# Altium schematic sheet MCUs.SchDoc
size B; SheetNumber: 5; SheetTotal: 7
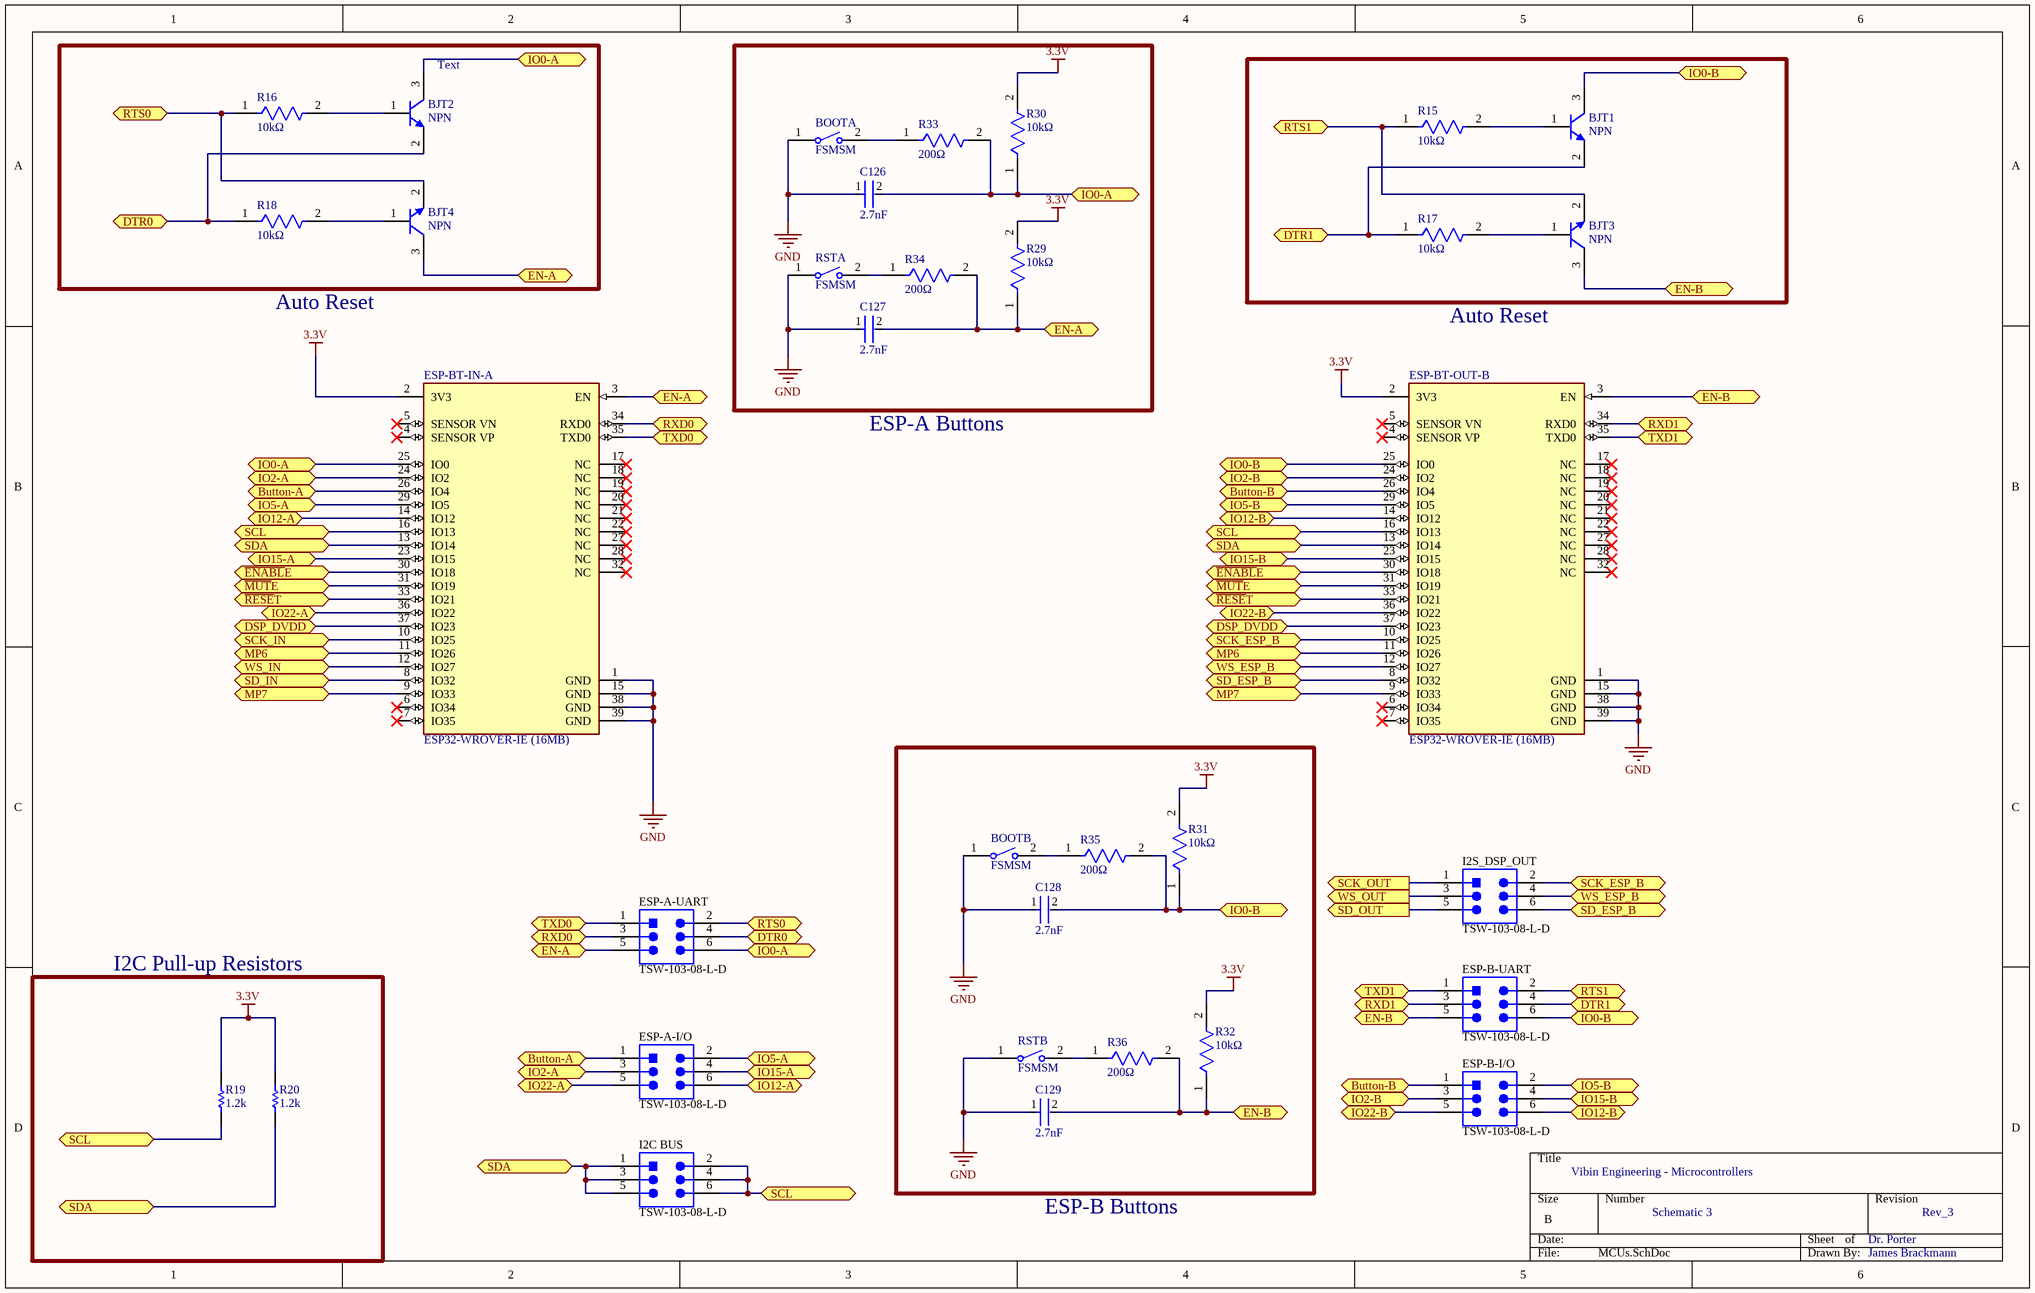
[diagram p0: MCUs.SchDoc]

## Parts
BJT1  NPN  [ONSC-SOT-23-3-318-08_V]
BJT2  NPN  [ONSC-SOT-23-3-318-08_V]
BJT3  NPN  [ONSC-SOT-23-3-318-08_V]
BJT4  NPN  [ONSC-SOT-23-3-318-08_V]
BOOTA  FSMSM  [TECO-FSMSM-2_V]
BOOTB  FSMSM  [TECO-FSMSM-2_V]
C126  2.7nF  [FP-C0402-BB-MFG]
C127  2.7nF  [FP-C0402-BB-MFG]
C128  2.7nF  [FP-C0402-BB-MFG]
C129  2.7nF  [FP-C0402-BB-MFG]
ESP-A-I/O  TSW-103-08-L-D  [SMTC-TSW-103-08-L-D_V]
ESP-A-UART  TSW-103-08-L-D  [SMTC-TSW-103-08-L-D_V]
ESP-B-I/O  TSW-103-08-L-D  [SMTC-TSW-103-08-L-D_V]
ESP-B-UART  TSW-103-08-L-D  [SMTC-TSW-103-08-L-D_V]
ESP-BT-IN-A  ESP32-WROVER-IE (16MB)  [FP-ESP32-WROVER-IE_16MB-MFG]
ESP-BT-OUT-B  ESP32-WROVER-IE (16MB)  [FP-ESP32-WROVER-IE_16MB-MFG]
I2C_BUS  TSW-103-08-L-D  [SMTC-TSW-103-08-L-D_V]
I2S_DSP_OUT  TSW-103-08-L-D  [SMTC-TSW-103-08-L-D_V]
R15  10kΩ  [FP-RC0603-0_55-IPC_C]
R16  10kΩ  [FP-RC0603-0_55-IPC_C]
R17  10kΩ  [FP-RC0603-0_55-IPC_C]
R18  10kΩ  [FP-RC0603-0_55-IPC_C]
R19  1.2k  [RESC1608X55X25LL10T15]
R20  1.2k  [RESC1608X55X25LL10T15]
R29  10kΩ  [FP-RC0603-0_55-IPC_C]
R30  10kΩ  [FP-RC0603-0_55-IPC_C]
R31  10kΩ  [FP-RC0603-0_55-IPC_C]
R32  10kΩ  [FP-RC0603-0_55-IPC_C]
R33  200Ω  [FP-ERJ2RK-IPC_A]
R34  200Ω  [FP-ERJ2RK-IPC_A]
R35  200Ω  [FP-ERJ2RK-IPC_A]
R36  200Ω  [FP-ERJ2RK-IPC_A]
RSTA  FSMSM  [TECO-FSMSM-2_V]
RSTB  FSMSM  [TECO-FSMSM-2_V]

## Blocks framed on the sheet
Text: BJT2 BJT4 R16 R18
I2C Pull-up Resistors: R19 R20

## Ports
Button-A (bidir), Button-B (bidir), DSP_DVDD (bidir), DTR0 (bidir), DTR1 (bidir), EN-A (bidir), EN-B (bidir), IO0-A (bidir), IO0-B (bidir), IO2-A (bidir), IO2-B (bidir), IO5-A (bidir), IO5-B (bidir), IO12-A (bidir), IO12-B (bidir), IO15-A (bidir), IO15-B (bidir), IO22-A (bidir), IO22-B (bidir), MP6 (bidir), MP7 (bidir), RTS0 (bidir), RTS1 (bidir), RXD0 (bidir), RXD1 (bidir), SCK_ESP_B (bidir), SCK_IN (bidir), SCK_OUT (out), SCL (bidir), SD_ESP_B (bidir), SD_IN (bidir), SD_OUT (out), SDA (bidir), TXD0 (bidir), TXD1 (bidir), WS_ESP_B (bidir), WS_IN (bidir), WS_OUT (out), ~{ENABL}E (bidir), ~{MUT}E (bidir), ~{RESE}T (bidir)

## Nets
3.3V: ESP-BT-IN-A.2(3V3) ESP-BT-OUT-B.2(3V3) R19.2 R20.2 R29.2 R30.2 R31.2 R32.2
GND: BOOTA.1 BOOTB.1 C126.1 C127.1 C128.1 C129.1 ESP-BT-IN-A.1(GND) ESP-BT-IN-A.15(GND) ESP-BT-IN-A.38(GND) ESP-BT-IN-A.39(GND) ESP-BT-OUT-B.1(GND) ESP-BT-OUT-B.15(GND) ESP-BT-OUT-B.38(GND) ESP-BT-OUT-B.39(GND) RSTA.1 RSTB.1
~{ENABL}E: ESP-BT-IN-A.30(IO18) ESP-BT-OUT-B.30(IO18) ; port ~{ENABL}E
~{MUT}E: ESP-BT-IN-A.31(IO19) ESP-BT-OUT-B.31(IO19) ; port ~{MUT}E
~{RESE}T: ESP-BT-IN-A.33(IO21) ESP-BT-OUT-B.33(IO21) ; port ~{RESE}T
Button-A: ESP-A-I/O.1 ESP-BT-IN-A.26(IO4) ; port Button-A
Button-B: ESP-B-I/O.1 ESP-BT-OUT-B.26(IO4) ; port Button-B
DSP_DVDD: ESP-BT-IN-A.37(IO23) ESP-BT-OUT-B.37(IO23) ; port DSP_DVDD
DTR0: BJT2.2(E) ESP-A-UART.4 R18.1 ; port DTR0
DTR1: BJT1.2(E) ESP-B-UART.4 R17.1 ; port DTR1
EN-A: BJT4.3(C) C127.2 ESP-A-UART.5 ESP-BT-IN-A.3(EN) R29.1 R34.2 ; port EN-A
EN-B: BJT3.3(C) C129.2 ESP-B-UART.5 ESP-BT-OUT-B.3(EN) R32.1 R36.2 ; port EN-B
IO0-A: BJT2.3(C) C126.2 ESP-A-UART.6 ESP-BT-IN-A.25(IO0) R30.1 R33.2 ; port IO0-A
IO0-B: BJT1.3(C) C128.2 ESP-B-UART.6 ESP-BT-OUT-B.25(IO0) R31.1 R35.2 ; port IO0-B
IO2-A: ESP-A-I/O.3 ESP-BT-IN-A.24(IO2) ; port IO2-A
IO2-B: ESP-B-I/O.3 ESP-BT-OUT-B.24(IO2) ; port IO2-B
IO5-A: ESP-A-I/O.2 ESP-BT-IN-A.29(IO5) ; port IO5-A
IO5-B: ESP-B-I/O.2 ESP-BT-OUT-B.29(IO5) ; port IO5-B
IO12-A: ESP-A-I/O.6 ESP-BT-IN-A.14(IO12) ; port IO12-A
IO12-B: ESP-B-I/O.6 ESP-BT-OUT-B.14(IO12) ; port IO12-B
IO15-A: ESP-A-I/O.4 ESP-BT-IN-A.23(IO15) ; port IO15-A
IO15-B: ESP-B-I/O.4 ESP-BT-OUT-B.23(IO15) ; port IO15-B
IO22-A: ESP-A-I/O.5 ESP-BT-IN-A.36(IO22) ; port IO22-A
IO22-B: ESP-B-I/O.5 ESP-BT-OUT-B.36(IO22) ; port IO22-B
MP6: ESP-BT-IN-A.11(IO26) ESP-BT-OUT-B.11(IO26) ; port MP6
MP7: ESP-BT-IN-A.9(IO33) ESP-BT-OUT-B.9(IO33) ; port MP7
RTS0: BJT4.2(E) ESP-A-UART.2 R16.1 ; port RTS0
RTS1: BJT3.2(E) ESP-B-UART.2 R15.1 ; port RTS1
RXD0: ESP-A-UART.3 ESP-BT-IN-A.34(RXD0) ; port RXD0
RXD1: ESP-B-UART.3 ESP-BT-OUT-B.34(RXD0) ; port RXD1
SCK_ESP_B: ESP-BT-OUT-B.10(IO25) I2S_DSP_OUT.2 ; port SCK_ESP_B
SCK_IN: ESP-BT-IN-A.10(IO25) ; port SCK_IN
SCK_OUT: I2S_DSP_OUT.1 ; port SCK_OUT
SCL: ESP-BT-IN-A.16(IO13) ESP-BT-OUT-B.16(IO13) I2C_BUS.2 I2C_BUS.4 I2C_BUS.6 R19.1 ; port SCL
SD_ESP_B: ESP-BT-OUT-B.8(IO32) I2S_DSP_OUT.6 ; port SD_ESP_B
SD_IN: ESP-BT-IN-A.8(IO32) ; port SD_IN
SD_OUT: I2S_DSP_OUT.5 ; port SD_OUT
SDA: ESP-BT-IN-A.13(IO14) ESP-BT-OUT-B.13(IO14) I2C_BUS.1 I2C_BUS.3 I2C_BUS.5 R20.1 ; port SDA
TXD0: ESP-A-UART.1 ESP-BT-IN-A.35(TXD0) ; port TXD0
TXD1: ESP-B-UART.1 ESP-BT-OUT-B.35(TXD0) ; port TXD1
WS_ESP_B: ESP-BT-OUT-B.12(IO27) I2S_DSP_OUT.4 ; port WS_ESP_B
WS_IN: ESP-BT-IN-A.12(IO27) ; port WS_IN
WS_OUT: I2S_DSP_OUT.3 ; port WS_OUT
NetBJT1_1: BJT1.1(B) R15.2
NetBJT2_1: BJT2.1(B) R16.2
NetBJT3_1: BJT3.1(B) R17.2
NetBJT4_1: BJT4.1(B) R18.2
NetBOOTA_2: BOOTA.2 R33.1
NetBOOTB_2: BOOTB.2 R35.1
NetR34_1: R34.1 RSTA.2
NetR36_1: R36.1 RSTB.2

Not connected (* = marked no-connect by the designer): ESP-BT-IN-A 4(SENSOR_VP)* 5(SENSOR_VN)* 6(IO34)* 7(IO35)* 17(NC)* 18(NC)* 19(NC)* 20(NC)* 21(NC)* 22(NC)* 27(NC)* 28(NC)* 32(NC)*; ESP-BT-OUT-B 4(SENSOR_VP)* 5(SENSOR_VN)* 6(IO34)* 7(IO35)* 17(NC)* 18(NC)* 19(NC)* 20(NC)* 21(NC)* 22(NC)* 27(NC)* 28(NC)* 32(NC)*

## Notes on the sheet
- Auto Reset
- ESP-A Buttons
- Vibin Engineering - Microcontrollers
- ESP-B Buttons
- Schematic 3
- Dr. Porter
- Rev_3
- James Brackmann

## Library data of the parts
BJT1-BJT4 = CMP-1048-00627-1: Amplifier Transistor, NPN Silicon, 3-Pin SOT-23, Pb-Free, Tape and Reel       NSVMMBT6429LT1G; Manufacturer: On Semiconductor; IC Continuous (A): 0.2; fT Min (MHz): 100; ComponentLink3URL: http://www.onsemi.cn/pub_link/Collateral/318-08.PDF; Mounting Technology: Surface Mount; ComponentLink2Description: Datasheet; Polarity: NPN; DatasheetVersion: Rev. 6; PackageReference: SOT-23-3-318-08; Packing: Tape and Reel; PackageVersion: Rev. AP, 11/2009; ComponentLink1URL: http://www.onsemi.com/; ComponentLink3Description: Package Specification; RoHS: TRUE; PackageDescription: 3-Pin Small Outline Transistor, Body 2.92 x 1.3 mm, Pitch 0.95 mm; ComponentLink2URL: http://www.onsemi.com/pub_link/Collateral/MMBT6428LT1-D.PDF; PartNumber: NSVMMBT6429LT1G; ComponentLink1Description: Manufacturer URL
BOOTA BOOTB RSTA RSTB = CMP-2000-07511-1: FSMSM Push Button Switch, 50 mA, -35 to 85 degC, 2-Pin SMD, RoHS, Bulk        506-FSMSM; Manufacturer: TE Connectivity; Actuator Length: 1.07mm; Electrical Life: 20000Cycles; Actuator Material: Polyamide; Current Rating: 50mA; Illumination Type: Illuminated; Voltage Rating (DC): 24V; Contact Resistance: 100mOhm; Case\/Package: SMD/SMT; Operating Force: 180gf; Switch Travel: 0.25mm; Max Voltage Rating (DC): 12V; Throw Configuration: SPST; Packaging: LoosePiece; Max Operating Temperature: 85degC; ELV: Compliant; Package Description: 2-Pin Surface Mount Device, Body 6 x 3.5 mm, Pitch 9.19 mm; RoHSCompliant: true; Manufacturer URL: http://www.te.com/; Contact Plating: Silver; Contact Material: Brass; Mounting Technology: SurfaceMount; Contact Current Rating: 50mA; Datasheet Version: Rev. C2, 08/2014; Datasheet URL: http://www.te.com/commerce/DocumentDelivery/DDEController?Action=showdoc&DocId=Customer+Drawing%7F1437566-3%7FC2%7Fpdf%7FEnglish%7FENG_CD_1437566-3_C2_1437566_3_1_c.dwg.pdf%7F1437566-3; Mechanical Life: 20000Cycles; Package Reference: FSMSM; REACH SVHC: Unknown; Orientation: Straight; Min Operating Temperature: -35degC; Lead Free: LeadFree; Termination: GullWing; Package Quantity: 1000; Mount: SurfaceMount
C126-C129 = CMP-2008-03164-3: C0402 2,700 pF X7R 5.00% 10 V        C0402C272J8RACAUTO; Manufacturer: Kemet; Material: Ceramic; Tolerance: 0.05; Temperature Coefficient: 15%; Voltage Rating: 10 V; Octopart: https://octopart.com/c0402c272j8racauto-kemet-16435644; Manufacturer Part Number: C0402C272J8RACAUTO; Device Class L2: Capacitors; Temperature Range Low: -55°C; Mouser Description: Cap Ceramic 0.0027uF 10V X7R 5% SMD 0402 125°C Bulk; Ipc Land Pattern Name: CAPC10050X50; Device Class L3: Ceramic Capacitors; Lead Free: Yes; Temperature Range High: +125°C; Automotive: No; ComponentLink2URL: https://content.kemet.com/datasheets/KEM_C1002_X7R_SMD.pdf; Temperature: -55°C to +125°C; Height: 0.55mm; RoHS: TRUE; Value: 2,700 pF; Package: C0402-BB; Temperature Characteristic: X7R; Device Class L1: Passive Components; Category: Cap; Capacitance: 2,700 pF; ComponentLink2Description: Datasheet
ESP-A-I/O ESP-A-UART ESP-B-I/O ESP-B-UART I2C_BUS I2S_DSP_OUT = CMP-1024-00336-5: Male Header, Pitch 2.54 mm, 2 x 3 Position, Height 8.38 mm, Tail Length 5.08 mm, -55 to 125 degC, RoHS, Bulk; Manufacturer: Samtec; DatasheetVersion: 04/2012; ComponentLink3URL: http://suddendocs.samtec.com/prints/tsw-xxx-xx-x-x-xx-xxx-footprint.pdf; PackageReference: TSW-103-08-L-D; Mounting Technology: Through Hole; Min Operating Temperature: -55 degC; ComponentLink2Description: Datasheet; Lead Pitch: 2.54 mm; ComponentLink1Description: Manufacturer URL; Mount: Through Hole; ComponentLink1URL: http://www.samtec.com/; ComponentLink3Description: Package Specification; Max Operating Temperature: 125 degC; PackageDescription: Male Header, Pitch 2.54 mm, 2 x 3 Position, Height 8.38 mm, Tail Length 5.08 mm; ComponentLink2URL: https://datasheet.ciiva.com/25618/0900766b81154476-25618436.pdf; RoHSCompliant: true
ESP-BT-IN-A ESP-BT-OUT-B = CMP-194065-000028-1: RX TXRX MOD WIFI EXT IPEX SMD
R15 R16 = CMP-2100-03664-2: RES 10K OHM 1% 1/10W 0603        RC0603FR-0710KL; Voltage Rating: 75V; Voltage Rating (DC): 50V; Resistance: 10kR; Power Rating: 100mW; Temperature Coefficient: 100ppm/°C; Depth: 0.8mm; Termination: SMD/SMT; Resistor Type: Thick Film; Series: RC; Construction: Rectangular; Features: Moisture Resistant; Packaging: Tape and Reel; Min Operating Temperature: -55°C; Number of Terminations: 2; Lead Pitch: 0.3mm; RoHS Compliant: Yes; Case/Package: 0603; Resistance Tolerance: 1%; Military Standard: Not; Weight: 7.1E-05oz; Number of Pins: 2; Tolerance: 1%; Length: 1.6mm; Case Code (Imperial): 0603; Lead Free: Lead Free; Width: 0.8mm; Max Power Dissipation: 100mW; Height: 0.45mm; Max Operating Temperature: 155°C; Case Code (Metric): 1608; Size Code: 0603
R17 R18 R29-R32 = CMP-2100-03664-2: RES 10K OHM 1% 1/10W 0603      RC0603FR-0710KL; Voltage Rating: 75V; Voltage Rating (DC): 50V; Resistance: 10kR; Power Rating: 100mW; Temperature Coefficient: 100ppm/°C; Depth: 0.8mm; Termination: SMD/SMT; Resistor Type: Thick Film; Series: RC; Construction: Rectangular; Features: Moisture Resistant; Packaging: Tape and Reel; Min Operating Temperature: -55°C; Number of Terminations: 2; Lead Pitch: 0.3mm; RoHS Compliant: Yes; Case/Package: 0603; Resistance Tolerance: 1%; Military Standard: Not; Weight: 7.1E-05oz; Number of Pins: 2; Tolerance: 1%; Length: 1.6mm; Case Code (Imperial): 0603; Lead Free: Lead Free; Width: 0.8mm; Max Power Dissipation: 100mW; Height: 0.45mm; Max Operating Temperature: 155°C; Case Code (Metric): 1608; Size Code: 0603
R19 R20 = CMP-1659-00042-1: Chip Resistor, 1.2 KOhm, +/- 1%, 0.1 W, -55 to 155 degC, 0603 (1608 Metric), RoHS, Tape and Reel         RC0603FR-071K2L; Resistance: 825 kohm; Voltage Rating: 50 V; Power Rating: 100 mW; Case\Package: 0603; DatasheetVersion: Rev. 4, 02/2016; Package Quantity: 5000; Min Operating Temperature: -55 degC; PackageReference: 0603; ComponentLink1Description: Manufacturer URL; Tolerance: 1%; ComponentLink2Description: Datasheet; Packaging: Tape and Reel; PackageDescription: 2-Pin Surface Mount Device, Body 1.6 x 0.8 mm; Width: 0.8 mm; ComponentLink2URL: http://www.yageo.com/documents/recent/PYu-RC_Group_51_RoHS_L_04.pdf; ComponentLink1URL: http://www.yageo.com/; Max Operating Temperature: 155 degC; RoHSCompliant: true; Height: 0.45 mm; Case Code (Imperial): 0603; Case Code (Metric): 1608; Length: 1.6 mm
R33-R36 = CMP-2002-00757-2: RES SMD 200 OHM 1% 1/10W 0402    ERJ-2RKF2000X; Power Rating: 100mW; Voltage Rating (DC): 50V; Resistance: 200R; Temperature Coefficient: 100ppm/°C; RoHS Compliant: Yes; Packaging: Tape and Reel; Case Code (Metric): 1005; Package Quantity: 1; Contact Plating: Tin; Series: ERJ; Mount: Surface Mount; Lead Free: Lead Free; Min Operating Temperature: -55°C; Number of Terminations: 2; Max Power Dissipation: 100mW; Technology: THICK FILM; Voltage Rating: 50V; Case/Package: 0402; Width: 0.02inch; Termination: SMD/SMT; Military Standard: Not; Height: 0.35mm; Radiation Hardening: No; Resistance Tolerance: 1%; Length: 1mm; REACH SVHC: No SVHC; Construction: Rectangular; Depth: 0.5mm; Features: Automotive AEC-Q200; Resistor Type: Thick Film; Case Code (Imperial): 0402; Tolerance: 1%; Size Code: 0402; Max Operating Temperature: 155°C